# Altium project hw_design.PrjPcb (part 5 of 5)

## Sheet connectors.SchDoc
size A4; SheetNumber: 5; SheetTotal: 5
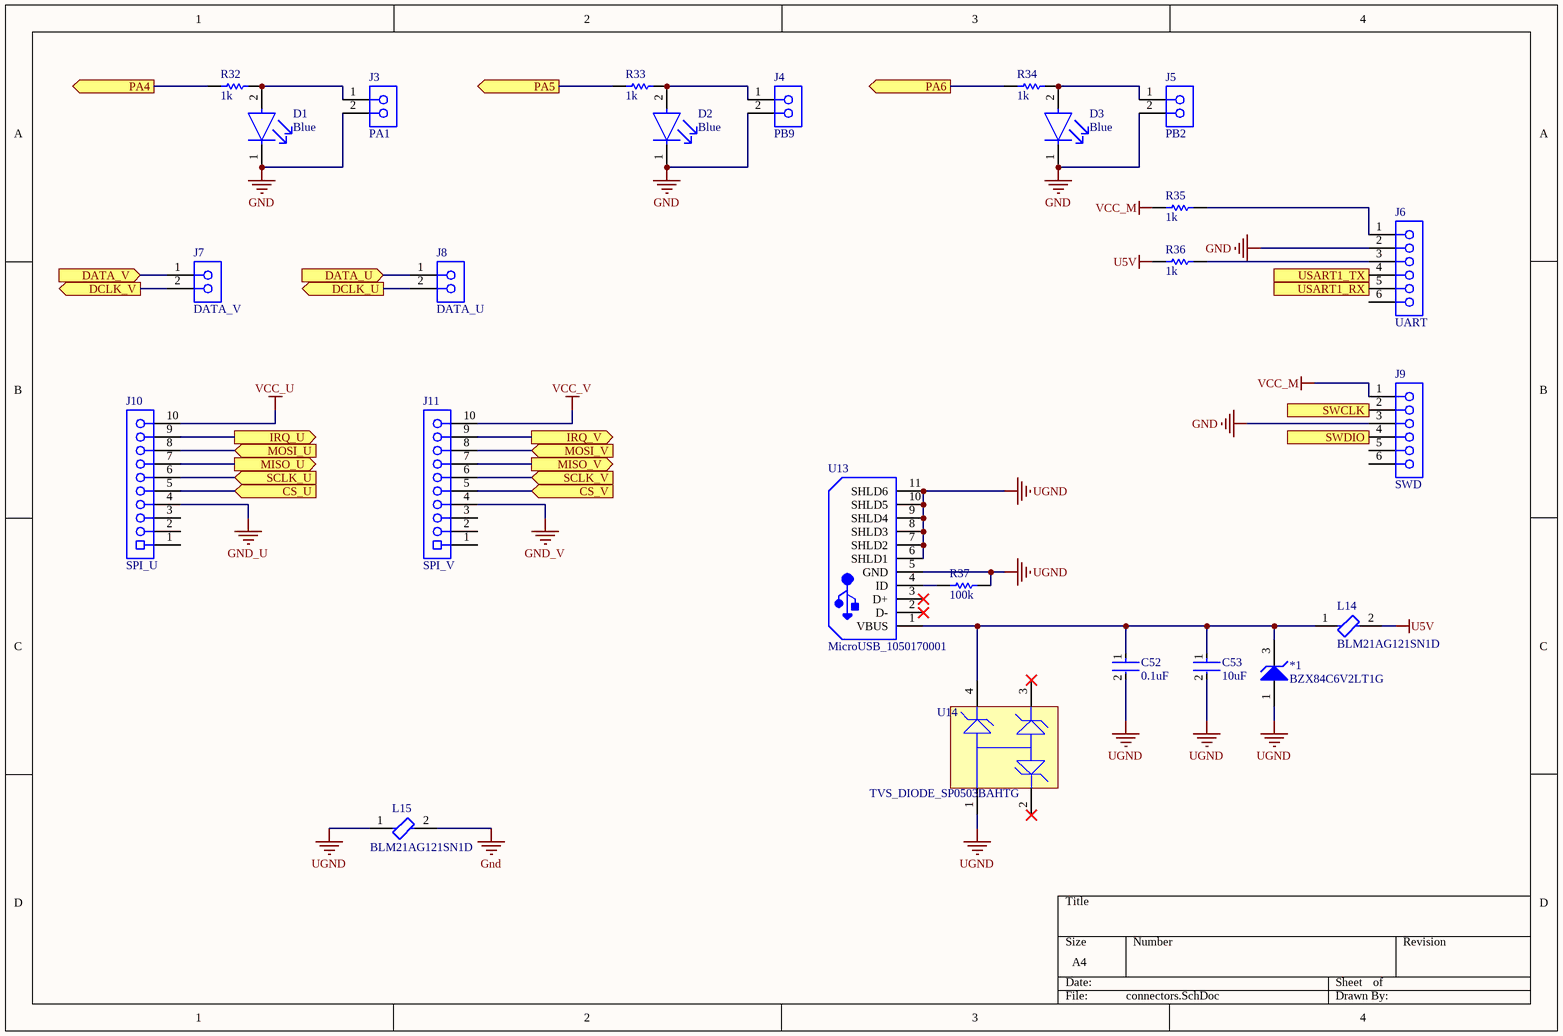
[diagram p4: connectors.SchDoc]

### Parts
*1  BZX84C6V2LT1G  [ONSC-SOT-23-3-318-08_V]
C52  0.1uF  [FP-C0805C-DN-IPC_A]
C53  10uF  [FP-C0805C-DN-IPC_A]
D1  Blue  [FP-C0805C-DN-IPC_A]
D2  Blue  [FP-C0805C-DN-IPC_A]
D3  Blue  [FP-C0805C-DN-IPC_A]
J3  PA1  [SMTC-SSQ-102-01-X-S]
J4  PB9  [SMTC-SSQ-102-01-X-S]
J5  PB2  [SMTC-SSQ-102-01-X-S]
J6  UART  [SMTC-SSW-106-02-X-S-RA]
J7  DATA_V  [SMTC-SSQ-102-01-X-S]
J8  DATA_U  [SMTC-SSQ-102-01-X-S]
J9  SWD  [SMTC-SSW-106-02-X-S-RA]
J10  SPI_U  [61301011821]
J11  SPI_V  [61301011821]
L14  BLM21AG121SN1D  [FP-C0805C-DN-IPC_A]
L15  BLM21AG121SN1D  [FP-C0805C-DN-IPC_A]
R32  1k  [FP-C0805C-DN-IPC_A]
R33  1k  [FP-C0805C-DN-IPC_A]
R34  1k  [FP-C0805C-DN-IPC_A]
R35  1k  [FP-C0805C-DN-IPC_A]
R36  1k  [FP-C0805C-DN-IPC_A]
R37  100k  [FP-C0805C-DN-IPC_A]
U13  MicroUSB_1050170001  [USB-MICRO-B_V]
U14  TVS_DIODE_SP0503BAHTG  [LFUS-SOT143-4_V]

### Ports
CS_U (in), CS_V (in), DATA_U (in), DATA_V (in), DCLK_U (out), DCLK_V (out), IRQ_U (out), IRQ_V (out), MISO_U (out), MISO_V (out), MOSI_U (in), MOSI_V (in), PA4 (out), PA5 (out), PA6 (out), SCLK_U (in), SCLK_V (in), SWCLK (in), SWDIO (out), USART1_RX (in), USART1_TX (out)

### Nets
GND: D1.1(C) D2.1(C) D3.1(C) J3.2 J4.2 J5.2 J6.2 J9.3 L15.2
GND_U: J10.4
GND_V: J11.4
U5V: L14.2 R36.1
UGND: *1.1(A) C52.2 C53.2 L15.1 R37.2 U13.5(GND) U13.6(SHLD1) U13.7(SHLD2) U13.8(SHLD3) U13.9(SHLD4) U13.10(SHLD5) U13.11(SHLD6) U14.1
VCC_M: J9.1 R35.1
VCC_U: J10.10
VCC_V: J11.10
CS_U: J10.5 ; port CS_U
CS_V: J11.5 ; port CS_V
DATA_U: J8.1 ; port DATA_U
DATA_V: J7.1 ; port DATA_V
DCLK_U: J8.2 ; port DCLK_U
DCLK_V: J7.2 ; port DCLK_V
IRQ_U: J10.9 ; port IRQ_U
IRQ_V: J11.9 ; port IRQ_V
MISO_U: J10.7 ; port MISO_U
MISO_V: J11.7 ; port MISO_V
MOSI_U: J10.8 ; port MOSI_U
MOSI_V: J11.8 ; port MOSI_V
PA4: R32.1 ; port PA4
PA5: R33.1 ; port PA5
PA6: R34.1 ; port PA6
SCLK_U: J10.6 ; port SCLK_U
SCLK_V: J11.6 ; port SCLK_V
SWCLK: J9.2 ; port SWCLK
SWDIO: J9.4 ; port SWDIO
USART1_RX: J6.5 ; port USART1_RX
USART1_TX: J6.4 ; port USART1_TX
Net*1_3: *1.3(K) C52.1 C53.1 L14.1 U13.1(VBUS) U14.4
NetD1_2: D1.2(A) J3.1 R32.2
NetD2_2: D2.2(A) J4.1 R33.2
NetD3_2: D3.2(A) J5.1 R34.2
NetJ6_1: J6.1 R35.2
NetJ6_3: J6.3 R36.2
NetR37_1: R37.1 U13.4(ID)

Not connected (* = marked no-connect by the designer): J6 6; J9 5 6; J10 1 2 3; J11 1 2 3; U13 2(D-)* 3(D+)*; U14 2* 3*

### Library data of the parts
*1 = BZX84C6V2LT1G: Vz=6.2V 5.8V~6.6V Izt=5mA P=250mW; Manufacturer: ON Semiconductor; Max Power Dissipation: 225mW; Tolerance: 6%; Zener Voltage: 6.2V; Max Reverse Leakage Current: 3uA; Power Dissipation: 300mW; Test Current: 5mA; Element Configuration: Single; Forward Voltage: 900mV; Impedance: 10R; Zener Current: 10mA; ESD Protection: Yes; Breakdown Voltage: 6.6V; Supplier 1: Digi-Key; Manufacturer Part Number: BZX84C6V2LT1G; RoHS: Yes; Category: Zener Diodes; Pricing 1: 1=0.18000, 10=0.16000, 100=0.08720, 500=0.05364, 1000=0.03657 (USD); Mount: Surface Mount; Case/Package: SOT-23; Number of Pins: 3; Contact Plating: Tin,Matte; Material: Plastic; Min Operating Temperature: -65°C; Max Operating Temperature: 150°C; Package Quantity: 3000; Packaging: Tape and Reel; Voltage Tolerance: 6%; Working Voltage: 6.2V; Max Reverse Current: 3uA; Voltage Rating (DC): 6.2V; Power Rating: 225mW; Termination: SMD/SMT; Length: 2.9mm; Width: 1.3mm; Height: 0.94mm; Radiation Hardening: No; Lead Free: Lead Free; RoHS Compliant: Yes; REACH SVHC: No SVHC; ComponentLink1URL: https://datasheet.ciiva.com/18434/70100187-18434638.pdf?src-supplier=Allied+Electronics; ComponentLink1Description: https://datasheet.ciiva.com/18434/70100187-18434638.pdf?src-supplier=Allied+Electronics; ComponentLink2URL: https://datasheet.ciiva.com/4731/bzx84c2v4lt1-d-71024-4731774.pdf?src-supplier=Mouser; ComponentLink2Description: https://datasheet.ciiva.com/4731/bzx84c2v4lt1-d-71024-4731774.pdf?src-supplier=Mouser; ComponentLink3URL: https://datasheet.ciiva.com/8345/bzx84c2v4lt1-d-8345722.pdf?src-supplier=Avnet; ComponentLink3Description: https://datasheet.ciiva.com/8345/bzx84c2v4lt1-d-8345722.pdf?src-supplier=Avnet; ComponentLink4URL: https://datasheet.ciiva.com/16348/bzx84c2v4lt1-d-16348201.pdf?src-supplier=Future+Electronics; ComponentLink4Description: https://datasheet.ciiva.com/16348/bzx84c2v4lt1-d-16348201.pdf?src-supplier=Future+Electronics; ComponentLink5URL: https://datasheet.ciiva.com/8347/bzx84c2v4lt1-d-8347285.pdf?src-supplier=Avnet; ComponentLink5Description: https://datasheet.ciiva.com/8347/bzx84c2v4lt1-d-8347285.pdf?src-supplier=Avnet; ComponentLink6URL: https://datasheet.ciiva.com/894/bzx84c2v4lt1-d-894738.pdf?src-supplier=Digi-Key; ComponentLink6Description: https://datasheet.ciiva.com/894/bzx84c2v4lt1-d-894738.pdf?src-supplier=Digi-Key; ComponentLink7URL: https://datasheet.ciiva.com/894/bzx84c2v4lt1-d-894739.pdf?src-supplier=Digi-Key; ComponentLink7Description: https://datasheet.ciiva.com/894/bzx84c2v4lt1-d-894739.pdf?src-supplier=Digi-Key; ComponentLink8URL: https://datasheet.ciiva.com/894/bzx84c2v4lt1-d-894737.pdf?src-supplier=Digi-Key; ComponentLink8Description: https://datasheet.ciiva.com/894/bzx84c2v4lt1-d-894737.pdf?src-supplier=Digi-Key; Stock 1: 1080; Supplier Part Number 1: BZX84C6V2LT1GOSCT-ND
C52 = C0805C104K5RACTU: Cap Ceramic 0.1uF 50V X7R 10% SMD 2.0 x 1.2 mm 125 C Paper T/R; Manufacturer: KEMET; Capacitance: 100nF; Voltage: 500V; Supplier 1: Digi-Key; Manufacturer Part Number: C0805C104K5RACTU; RoHS: Yes; Category: Ceramic Capacitors; Pricing 1: 1=0.15000, 10=0.10500, 50=0.05960, 100=0.04940, 500=0.03466, 1000=0.02869 (USD); Mount: Surface Mount,PCB; Case/Package: 0805; Number of Pins: 2; Case Code (Imperial): 0805; Case Code (Metric): 2012; Dielectric Material: Ceramic; Contact Plating: Tin,Matte; Min Operating Temperature: -55°C; Max Operating Temperature: 125°C; Package Quantity: 4000; Voltage Rating: 50V; Tolerance: 10%; Packaging: Tape and Reel; Dielectric: X7R; Termination: SMD/SMT; Voltage Rating (DC): 50V; Series: C0805C; Construction: Flat; Length: 2mm; Width: 1.2mm; Height: 0.9mm; Thickness: 0.035inch; Depth: 1.25mm; Lead Pitch: 0.75mm; Radiation Hardening: No; REACH SVHC: No SVHC; RoHS Compliant: Yes; ComponentLink1URL: https://www.distrelec.biz/Web/Downloads/_t/ds/KEM_C1002_X7R_SMD_eng_tds.pdf?mime=application%2Fpdf&src-supplier=Distrelec; ComponentLink1Description: https://www.distrelec.biz/Web/Downloads/_t/ds/KEM_C1002_X7R_SMD_eng_tds.pdf?mime=application%2Fpdf&src-supplier=Distrelec; ComponentLink2URL: http://www.farnell.com/datasheets/2740684.pdf?src-supplier=Farnell; ComponentLink2Description: http://www.farnell.com/datasheets/2740684.pdf?src-supplier=Farnell; ComponentLink3URL: http://www.farnell.com/datasheets/2740684.pdf?src-supplier=Element14; ComponentLink3Description: http://www.farnell.com/datasheets/2740684.pdf?src-supplier=Element14; Supplier Part Number 1: 399-C0805C104K5RAC7800CT-ND; Stock 1: 2034176
C53 = GRM21BR61C106KE15L: 贴片电容（MLCC） 10μF ±10% 16V X5R 0805; Manufacturer: Murata; Material: Ceramic; Supplier 1: Digi-Key; Manufacturer Part Number: GRM21BR61C106KE15L; RoHS: Yes; Category: Ceramic Capacitors; Pricing 1: 1=0.18000, 10=0.12400, 50=0.07420, 100=0.06270, 500=0.04292, 1000=0.03798 (USD); Mount: Surface Mount; Case/Package: 0805; Case Code (Imperial): 0805; Case Code (Metric): 2012; Min Operating Temperature: -55°C; Max Operating Temperature: 85°C; Packaging: Tape and Reel; Capacitance: 10uF; Tolerance: 10%; Voltage Rating: 16V; Voltage Rating (DC): 16V; Package Quantity: 1; Dielectric: X5R; Termination: SMD/SMT; Voltage: 16V; Series: GRM; Construction: Flat; Length: 2mm; Width: 1.25mm; Height: 1.25mm; Thickness: 0.053inch; Depth: 1.25mm; Radiation Hardening: No; REACH SVHC: No SVHC; RoHS Compliant: Yes; Lead Free: Lead Free; ComponentLink1URL: https://datasheet.ciiva.com/7719/1747468-7719090.pdf?src-supplier=Element14; ComponentLink1Description: https://datasheet.ciiva.com/7719/1747468-7719090.pdf?src-supplier=Element14; ComponentLink2URL: https://datasheet.ciiva.com/23628/460993-23628598.pdf?src-supplier=Newark; ComponentLink2Description: https://datasheet.ciiva.com/23628/460993-23628598.pdf?src-supplier=Newark; ComponentLink3URL: https://datasheet.ciiva.com/2989/product-2989696.pdf?src-supplier=Avnet; ComponentLink3Description: https://datasheet.ciiva.com/2989/product-2989696.pdf?src-supplier=Avnet; ComponentLink4URL: https://datasheet.ciiva.com/3777/1956grm21br61c106ke1523-3777137.pdf?src-supplier=Arrow+Electronics; ComponentLink4Description: https://datasheet.ciiva.com/3777/1956grm21br61c106ke1523-3777137.pdf?src-supplier=Arrow+Electronics; ComponentLink5URL: https://datasheet.ciiva.com/29202/450891-da-01-de-vs-chip-kond-0805-10-0-uf-10pr-16-0v-x5r-29202696.pdf?src-supplier=Conrad; ComponentLink5Description: https://datasheet.ciiva.com/29202/450891-da-01-de-vs-chip-kond-0805-10-0-uf-10pr-16-0v-x5r-29202696.pdf?src-supplier=Conrad; ComponentLink6URL: https://datasheet.ciiva.com/29199/454607-da-01-en-vs-kondensator-0805-29199611.pdf?src-supplier=Conrad; ComponentLink6Description: https://datasheet.ciiva.com/29199/454607-da-01-en-vs-kondensator-0805-29199611.pdf?src-supplier=Conrad; ComponentLink7URL: https://datasheet.ciiva.com/137/partnumbering-e-01-137918.pdf?src-supplier=Digi-Key; ComponentLink7Description: https://datasheet.ciiva.com/137/partnumbering-e-01-137918.pdf?src-supplier=Digi-Key; ComponentLink8URL: https://datasheet.ciiva.com/137/partnumbering-e-01-137917.pdf?src-supplier=Digi-Key; ComponentLink8Description: https://datasheet.ciiva.com/137/partnumbering-e-01-137917.pdf?src-supplier=Digi-Key; ComponentLink9URL: https://datasheet.ciiva.com/137/partnumbering-e-01-137919.pdf?src-supplier=Digi-Key; ComponentLink9Description: https://datasheet.ciiva.com/137/partnumbering-e-01-137919.pdf?src-supplier=Digi-Key; ComponentLink10URL: https://datasheet.ciiva.com/2989/product-2989697.pdf?src-supplier=Avnet; ComponentLink10Description: https://datasheet.ciiva.com/2989/product-2989697.pdf?src-supplier=Avnet; Supplier Part Number 1: 490-3886-1-ND; Stock 1: 9508002
D1-D3 = LTST-C170TBKT: LED BLUE CLEAR 0805 SMD; Manufacturer: Vishay Lite-On; Lens Color: Colorless; Viewing Angle: 130°; Luminous Intensity: 180mcd; Forward Current: 20mA; Forward Voltage: 3.8V; Lens Style: Diffused,Colorless,Clear,Rectangular; Dominant Wavelength: 475nm; Wavelength: 468nm; Number of LEDs: 1; Power Rating: 76mW; Reverse Voltage: 5V; Supplier 1: Digi-Key; Manufacturer Part Number: LTST-C170TBKT; RoHS: Yes; Category: LEDs; Stock 1: 153274; Pricing 1: 1=0.36000, 10=0.23900, 100=0.15930, 500=0.11016, 1000=0.09180 (USD); Mount: Surface Mount; Case/Package: 0805; Number of Pins: 2; Color: Blue; Case Code (Metric): 2012; Case Code (Imperial): 0805; Min Operating Temperature: -20°C; Max Operating Temperature: 80°C; Packaging: Tape and Reel; Package Quantity: 1; Test Current: 20mA; Illumination Color: Blue; Series: -; Lens Transparency: Clear; Number of Elements: 1; Power Dissipation: 76mW; Length: 2mm; Width: 1.25mm; Height: 1.1mm; Depth: 1.25mm; Radiation Hardening: No; RoHS Compliant: Yes; Lead Free: Lead Free; ComponentLink1URL: https://datasheet.ciiva.com/27055/1996161-27055955.pdf?src-supplier=Jameco; ComponentLink1Description: https://datasheet.ciiva.com/27055/1996161-27055955.pdf?src-supplier=Jameco; ComponentLink2URL: https://datasheet.ciiva.com/11773/0900766b80dc0281-11773879.pdf?src-supplier=RSComponents; ComponentLink2Description: https://datasheet.ciiva.com/11773/0900766b80dc0281-11773879.pdf?src-supplier=RSComponents; ComponentLink3URL: https://datasheet.ciiva.com/12400/lite-on-ltst-c170tbkt-190169-12400787.pdf?src-supplier=Mouser; ComponentLink3Description: https://datasheet.ciiva.com/12400/lite-on-ltst-c170tbkt-190169-12400787.pdf?src-supplier=Mouser; ComponentLink4URL: https://datasheet.ciiva.com/16199/lite-on20ltst-c170tbkt-16199611.pdf?src-supplier=Future+Electronics; ComponentLink4Description: https://datasheet.ciiva.com/16199/lite-on20ltst-c170tbkt-16199611.pdf?src-supplier=Future+Electronics; ComponentLink5URL: https://datasheet.ciiva.com/15117/getdatasheetpartid-103986-15117447.pdf?src-supplier=Verical; ComponentLink5Description: https://datasheet.ciiva.com/15117/getdatasheetpartid-103986-15117447.pdf?src-supplier=Verical; ComponentLink6URL: https://datasheet.ciiva.com/25764/ltst-c170tbkt-25764828.pdf?src-supplier=Allied+Electronics; ComponentLink6Description: https://datasheet.ciiva.com/25764/ltst-c170tbkt-25764828.pdf?src-supplier=Allied+Electronics; ComponentLink7URL: https://datasheet.ciiva.com/2110/s-110-ltst-c170tbkt-2110489.pdf?src-supplier=Digi-Key; ComponentLink7Description: https://datasheet.ciiva.com/2110/s-110-ltst-c170tbkt-2110489.pdf?src-supplier=Digi-Key; ComponentLink8URL: https://datasheet.ciiva.com/2110/s-110-ltst-c170tbkt-2110488.pdf?src-supplier=Digi-Key; ComponentLink8Description: https://datasheet.ciiva.com/2110/s-110-ltst-c170tbkt-2110488.pdf?src-supplier=Digi-Key; ComponentLink9URL: https://datasheet.ciiva.com/2110/s-110-ltst-c170tbkt-2110490.pdf?src-supplier=Digi-Key; ComponentLink9Description: https://datasheet.ciiva.com/2110/s-110-ltst-c170tbkt-2110490.pdf?src-supplier=Digi-Key; Supplier Part Number 1: 160-1579-1-ND
J3-J5 J7 J8 = SSQ-102-01-G-S: Headers & Wire Housings Tiger Buy Socket Strip with Square Tails, 0.100 Pitch; Manufacturer: Samtec; Number of Contacts: 2; Gender: Receptacle; Contact Resistance: 10mR; Max Current Rating: 7.6A; Max Voltage Rating (AC): 550V; Pitch: 2.54mm; Supplier 1: Digi-Key; Manufacturer Part Number: SSQ-102-01-G-S; RoHS: Yes; Category: Headers and Wire Housings; Stock 1: 1869; Pricing 1: 1=0.50000, 10=0.46700, 25=0.42000, 50=0.37320, 100=0.35770, 250=0.32660, 500=0.31104 (USD); Mount: Through Hole; Contact Plating: Gold; Contact Material: Bronze; Color: Black; Housing Color: Black; Housing Material: Polymer; Min Operating Temperature: -55°C; Max Operating Temperature: 125°C; Number of Rows: 1; Termination: Solder; Packaging: Bulk; Connector Type: Receptacle; Number of Positions: 2; Orientation: Vertical; Series: SSQ; Contact Type: Female Socket; Current Rating: 7.6A; Voltage Rating: 550V; Length: 5.59mm; Depth: 2.41mm; Radiation Hardening: No; RoHS Compliant: Yes; Lead Free: Lead Free; REACH SVHC: No SVHC; ComponentLink1URL: https://datasheet.ciiva.com/25617/0900766b81159fd6-25617381.pdf?src-supplier=RSComponents; ComponentLink1Description: https://datasheet.ciiva.com/25617/0900766b81159fd6-25617381.pdf?src-supplier=RSComponents; ComponentLink2URL: https://datasheet.ciiva.com/22677/82032-22677596.pdf?src-supplier=Element14; ComponentLink2Description: https://datasheet.ciiva.com/22677/82032-22677596.pdf?src-supplier=Element14; ComponentLink3URL: https://datasheet.ciiva.com/748/ssq-1xx-xx-xxx-x-xx-xxx-xx-x-mkt-748393.pdf?src-supplier=Digi-Key; ComponentLink3Description: https://datasheet.ciiva.com/748/ssq-1xx-xx-xxx-x-xx-xxx-xx-x-mkt-748393.pdf?src-supplier=Digi-Key; Supplier Part Number 1: SAM1180-02-ND
J6 J9 = SSW-106-02-G-S-RA: Conn Socket Strip SKT 6 POS 2.54mm Solder RA Side Entry Thru-Hole Tube; Manufacturer: Samtec; Number of Contacts: 6; Gender: Receptacle; Max Current Rating: 6.9A; Max Voltage Rating (AC): 550V; Mating Cycles: 100; Contact Resistance: 10mR; Supplier 1: Digi-Key; Manufacturer Part Number: SSW-106-02-G-S-RA; RoHS: Yes; Category: Headers and Wire Housings; Stock 1: 2072; Pricing 1: 1=1.36000, 10=1.19700, 25=1.12680, 50=1.07980, 100=1.03280, 250=0.93888, 500=0.84500 (USD); Mount: Through Hole; Contact Plating: Gold; Contact Material: Bronze; Color: Black; Housing Color: Black; Housing Material: Polymer; Min Operating Temperature: -55°C; Max Operating Temperature: 125°C; Number of Rows: 1; Packaging: Bulk; Termination: Solder; Connector Type: Receptacle; Number of Positions: 6; Series: SSW; Contact Type: Female Socket; Orientation: Right Angle; Current Rating: 6.9A; Voltage Rating: 550V; Length: 15.75mm; Pitch: 2.54mm; Depth: 10.03mm; Radiation Hardening: No; RoHS Compliant: Yes; Lead Free: Lead Free; REACH SVHC: No SVHC; ComponentLink1URL: https://datasheet.ciiva.com/25617/0900766b8115c03d-25617516.pdf?src-supplier=RSComponents; ComponentLink1Description: https://datasheet.ciiva.com/25617/0900766b8115c03d-25617516.pdf?src-supplier=RSComponents; ComponentLink2URL: https://datasheet.ciiva.com/22677/82032-22677496.pdf?src-supplier=Element14; ComponentLink2Description: https://datasheet.ciiva.com/22677/82032-22677496.pdf?src-supplier=Element14; ComponentLink3URL: https://datasheet.ciiva.com/750/ssw-1xx-xx-xxx-x-xx-xxx-xx-mkt-750270.pdf?src-supplier=Digi-Key; ComponentLink3Description: https://datasheet.ciiva.com/750/ssw-1xx-xx-xxx-x-xx-xxx-xx-mkt-750270.pdf?src-supplier=Digi-Key; Supplier Part Number 1: SAM1225-06-ND
J10 J11 = 61301011821: THT Vertical Socket Header WR-PHD, Pitch 2.54 mm, Single Row, 10 pins; Manufacturer: Wurth Electronics; Number of Positions: 10; Current Rating: 3A; Gender: Receptacle; Voltage Rating: 250V; Insulation Resistance: 1GR; Insulation: Insulated; Pitch: 2.54mm; Supplier 1: Digi-Key; Manufacturer Part Number: 61301011821; RoHS: Yes; Category: Headers and Wire Housings; Stock 1: 2490; Pricing 1: 1=0.68000, 10=0.66300, 50=0.61200, 100=0.56100, 320=0.51000 (USD); Mount: Through Hole; Contact Plating: Gold; Contact Material: Copper Alloy,Copper; Housing Material: PBT; Color: Black; Min Operating Temperature: -40°C; Max Operating Temperature: 125°C; Number of Rows: 1; Termination: Through Hole; Series: WR-PHD; Package Quantity: 320; Contact Gender: Female; Packaging: Tray; Number of Contacts: 10; Connector Type: Header; Contact Type: Female Socket; Length: 25.9mm; Width: 25.9mm; Height: 8.5mm; RoHS Compliant: Yes; Flammability Rating: UL94 V-0; REACH SVHC: Unknown; Lead Free: Lead Free; ComponentLink1URL: https://datasheet.ciiva.com/8043/1320173-8043339.pdf?src-supplier=Element14; ComponentLink1Description: https://datasheet.ciiva.com/8043/1320173-8043339.pdf?src-supplier=Element14; ComponentLink2URL: https://datasheet.ciiva.com/755/6130xx11821-755848.pdf?src-supplier=Digi-Key; ComponentLink2Description: https://datasheet.ciiva.com/755/6130xx11821-755848.pdf?src-supplier=Digi-Key; ComponentLink3URL: https://datasheet.ciiva.com/48686/001088188-da-01-en-wr-phd-buchsenleiste-61301011821-48686454.pdf?src-supplier=Conrad; ComponentLink3Description: https://datasheet.ciiva.com/48686/001088188-da-01-en-wr-phd-buchsenleiste-61301011821-48686454.pdf?src-supplier=Conrad; Supplier Part Number 1: 732-2859-ND
L14 L15 = BLM21AG121SN1D: 0805 120Ω ±25% DCR=0.09Ω 1A ferrite bead; Manufacturer: Murata; Material: Steel,Ferrite; Impedance: 120R; Current Rating: 800mA; Max DC Current: 200mA; DC Resistance (DCR): 100mR; Test Frequency: 100MHz; Number of Lines: 1; Shielding: Unshielded; Resistance: 150mR; Supplier 1: Mouser; Manufacturer Part Number: BLM21AG121SN1D; RoHS: Yes; Category: Inductors; Pricing 1: 1=0.15000, 10=0.07700, 50=0.07700, 100=0.05300, 500=0.04800, 1000=0.04200, 4000=0.04000, 10000=0.04000 (USD); Case/Package: 0805; Number of Pins: 2; Case Code (Metric): 2012; Case Code (Imperial): 0805; Core Material: Ferrite; Min Operating Temperature: -55°C; Max Operating Temperature: 125°C; Package Quantity: 1; Packaging: Tape and Reel; Tolerance: 25%; Termination: SMD/SMT; Series: BLM21A; Max Current Rating: 1A; DC Resistance-Max: 100mR; DC Current: 200mA; Frequency: 100MHz; Number of Circuits: 1; Length: 2mm; Width: 1.25mm; Height: 0.85mm; Depth: 1.25mm; Radiation Hardening: No; REACH SVHC: No SVHC; Lead Free: Lead Free; RoHS Compliant: Yes; Military Standard: Not; ComponentLink1URL: https://datasheet.ciiva.com/5709/5155-5709216.pdf?src-supplier=Farnell; ComponentLink1Description: https://datasheet.ciiva.com/5709/5155-5709216.pdf?src-supplier=Farnell; ComponentLink2URL: https://datasheet.ciiva.com/41449/001172324-da-01-en-drossel-0805-120r-2-0x1-25mm-4000st-41449639.pdf?src-supplier=Conrad; ComponentLink2Description: https://datasheet.ciiva.com/41449/001172324-da-01-en-drossel-0805-120r-2-0x1-25mm-4000st-41449639.pdf?src-supplier=Conrad; ComponentLink3URL: https://datasheet.ciiva.com/29347/442447-da-01-en-chip-drossel-0805-120r-200ma-2-0x1-25mm-29347998.pdf?src-supplier=Conrad; ComponentLink3Description: https://datasheet.ciiva.com/29347/442447-da-01-en-chip-drossel-0805-120r-200ma-2-0x1-25mm-29347998.pdf?src-supplier=Conrad; ComponentLink4URL: https://datasheet.ciiva.com/1012/l0110s0100blm21a-1012654.pdf?src-supplier=Digi-Key; ComponentLink4Description: https://datasheet.ciiva.com/1012/l0110s0100blm21a-1012654.pdf?src-supplier=Digi-Key; ComponentLink5URL: https://datasheet.ciiva.com/1012/l0110s0100blm21a-1012653.pdf?src-supplier=Digi-Key; ComponentLink5Description: https://datasheet.ciiva.com/1012/l0110s0100blm21a-1012653.pdf?src-supplier=Digi-Key; ComponentLink6URL: https://datasheet.ciiva.com/1012/l0110s0100blm21a-1012655.pdf?src-supplier=Digi-Key; ComponentLink6Description: https://datasheet.ciiva.com/1012/l0110s0100blm21a-1012655.pdf?src-supplier=Digi-Key; ComponentLink7URL: https://datasheet.ciiva.com/3081/l0110s0100blm21a-3081641.pdf?src-supplier=Avnet; ComponentLink7Description: https://datasheet.ciiva.com/3081/l0110s0100blm21a-3081641.pdf?src-supplier=Avnet; ComponentLink8URL: https://datasheet.ciiva.com/16355/l0110s0100blm21a-16355286.pdf?src-supplier=Future+Electronics; ComponentLink8Description: https://datasheet.ciiva.com/16355/l0110s0100blm21a-16355286.pdf?src-supplier=Future+Electronics; ComponentLink9URL: https://datasheet.ciiva.com/3082/l0110s0100blm21a-3082729.pdf?src-supplier=Avnet; ComponentLink9Description: https://datasheet.ciiva.com/3082/l0110s0100blm21a-3082729.pdf?src-supplier=Avnet; Supplier Part Number 1: 81-BLM21AG121SN1D
R32-R36 = CRCW08051K00FKEA: Res Thick Film 0805 1K Ohm 1% 1/8W ±100ppm/°C Molded SMD Paper T/R; Manufacturer: Vishay Dale; Voltage Rating: 150V; Power Rating: 125mW; Resistance: 1kR; Supplier 1: Digi-Key; Manufacturer Part Number: CRCW08051K00FKEA; RoHS: Yes; Category: Chip SMD Resistors; Stock 1: 6505; Pricing 1: 1=0.10000, 10=0.06700, 100=0.02710, 1000=0.01219, 2500=0.01058 (USD); Case/Package: 0805; Number of Pins: 2; Case Code (Imperial): 0805; Case Code (Metric): 2012; Contact Plating: Tin; Size Code: 0805; Weight: 0.000194oz; Min Operating Temperature: -55°C; Max Operating Temperature: 155°C; Packaging: Tape and Reel; Tolerance: 1%; Resistor Type: Thick Film; Termination: SMD/SMT; Temperature Coefficient: 100ppm/°C; Series: CRCW; Max Power Dissipation: 125mW; Number of Terminations: 2; Resistance Tolerance: 1%; Package Quantity: 5000; Voltage Rating (DC): 150V; Construction: Rectangular; Features: Automotive AEC-Q200; Technology: THICK FILM; Length: 2mm; Width: 1.25mm; Height: 0.45mm; Depth: 1.25mm; Radiation Hardening: No; REACH SVHC: Unknown; RoHS Compliant: Yes; Military Standard: Not; Lead Free: Lead Free; ComponentLink1URL: https://datasheet.ciiva.com/11808/0900766b80d98b26-11808530.pdf?src-supplier=RSComponents; ComponentLink1Description: https://datasheet.ciiva.com/11808/0900766b80d98b26-11808530.pdf?src-supplier=RSComponents; ComponentLink2URL: https://datasheet.ciiva.com/3258/dcrcwe3-3258215.pdf?src-supplier=Avnet; ComponentLink2Description: https://datasheet.ciiva.com/3258/dcrcwe3-3258215.pdf?src-supplier=Avnet; ComponentLink3URL: https://datasheet.ciiva.com/26312/fld-crcw-e3-data-en-26312922.pdf?src-supplier=Distrelec; ComponentLink3Description: https://datasheet.ciiva.com/26312/fld-crcw-e3-data-en-26312922.pdf?src-supplier=Distrelec; ComponentLink4URL: https://datasheet.ciiva.com/16213/dcrcwe3-16213643.pdf?src-supplier=Future+Electronics; ComponentLink4Description: https://datasheet.ciiva.com/16213/dcrcwe3-16213643.pdf?src-supplier=Future+Electronics; ComponentLink5URL: https://datasheet.ciiva.com/46381/1697337-46381606.pdf?src-supplier=Element14; ComponentLink5Description: https://datasheet.ciiva.com/46381/1697337-46381606.pdf?src-supplier=Element14; ComponentLink6URL: https://datasheet.ciiva.com/46441/1720486-46441626.pdf?src-supplier=Element14; ComponentLink6Description: https://datasheet.ciiva.com/46441/1720486-46441626.pdf?src-supplier=Element14; Supplier Part Number 1: 541-1.00KCDKR-ND
R37 = RC0805FR-07100KL: 贴片电阻 100000Ω ± 1.00% 0.125W ± 100ppm/℃ 0805; Manufacturer: Yageo; Tolerance: 1%; Voltage Rating: 150V; Temperature Coefficient: 100ppm/°C; Resistance: 100kR; Power Rating: 125mW; Supplier 1: Digi-Key; Manufacturer Part Number: RC0805FR-07100KL; RoHS: Yes; Category: Chip SMD Resistors; Pricing 1: 1=0.10000, 10=0.04200, 100=0.01690, 1000=0.00759, 2500=0.00659 (USD); Case/Package: 0805; Number of Pins: 2; Case Code (Metric): 2012; Case Code (Imperial): 0805; Size Code: 0805; Min Operating Temperature: -55°C; Max Operating Temperature: 155°C; Voltage Rating (DC): 150V; Packaging: Tape and Reel; Termination: SMD/SMT; Series: RC; Package Quantity: 1; Resistor Type: Thick Film; Number of Terminations: 2; Max Power Dissipation: 125mW; Resistance Tolerance: 1%; Features: Moisture Resistant; Construction: Rectangular; Technology: THICK FILM; Length: 2mm; Width: 0.049inch; Height: 0.024inch; Depth: 1.25mm; Lead Pitch: 0.4mm; REACH SVHC: Unknown; RoHS Compliant: Yes; Lead Free: Lead Free; Military Standard: Not; ComponentLink1URL: https://datasheet.ciiva.com/7941/1686128-7941677.pdf?src-supplier=Element14; ComponentLink1Description: https://datasheet.ciiva.com/7941/1686128-7941677.pdf?src-supplier=Element14; ComponentLink2URL: https://datasheet.ciiva.com/7660/38627-7660796.pdf?src-supplier=Element14; ComponentLink2Description: https://datasheet.ciiva.com/7660/38627-7660796.pdf?src-supplier=Element14; Supplier Part Number 1: 311-100KCRCT-ND; Stock 1: 2547195
U13 = 1050170001: CONN RCPT MICRO USB R/A SMD; Manufacturer: Molex; Number of Terminals/Pins: 5; Gender: Receptacle; Connector Type: USB,Receptacle; USB Standard: USB 2.0; Current Rating: 1.8A; Number of Ports: 1; Voltage Rating (AC): 30V; Mating Cycles: 10000; Shielding: Shielded; Pitch: 0.65mm; Supplier 1: Digi-Key; Manufacturer Part Number: 1050170001; RoHS: Yes; Category: Connectors; Pricing 1: 1=0.96000, 10=0.79400, 100=0.66150, 1000=0.52920 (USD); Mount: Surface Mount,Through Hole,Horizontal; Contact Plating: Gold; Contact Material: Copper Alloy,Copper; Housing Material: Polymer; Insulation Color: Black; Min Operating Temperature: -30°C; Max Operating Temperature: 85°C; Packaging: Tape and Reel; Number of Contacts: 5; Orientation: Right Angle; Termination: Solder; Series: 105017; Max Voltage Rating (AC): 30V; Voltage Rating: 30V; Features: Shielded; Package Quantity: 2000; Number of Positions: 5; Number of Circuits: 5; Length: 8.2mm; Depth: 7.5mm; Radiation Hardening: No; REACH SVHC: Unknown; RoHS Compliant: Yes; Flammability Rating: UL94 V-0; Halogen Free: Low Halogen; ComponentLink1URL: https://datasheet.ciiva.com/30165/235271050170001-io-nectors-30165183.pdf?src-supplier=Onlinecomponents.com; ComponentLink1Description: https://datasheet.ciiva.com/30165/235271050170001-io-nectors-30165183.pdf?src-supplier=Onlinecomponents.com; ComponentLink2URL: https://datasheet.ciiva.com/8015/1631959-8015288.pdf?src-supplier=Element14; ComponentLink2Description: https://datasheet.ciiva.com/8015/1631959-8015288.pdf?src-supplier=Element14; ComponentLink3URL: https://datasheet.ciiva.com/5742/1598502-5742508.pdf?src-supplier=Farnell; ComponentLink3Description: https://datasheet.ciiva.com/5742/1598502-5742508.pdf?src-supplier=Farnell; ComponentLink4URL: https://datasheet.ciiva.com/22654/1688140-22654924.pdf?src-supplier=Element14; ComponentLink4Description: https://datasheet.ciiva.com/22654/1688140-22654924.pdf?src-supplier=Element14; ComponentLink5URL: https://datasheet.ciiva.com/3094/1050170001-io-connectors-3094416.pdf?src-supplier=Avnet; ComponentLink5Description: https://datasheet.ciiva.com/3094/1050170001-io-connectors-3094416.pdf?src-supplier=Avnet; ComponentLink6URL: https://datasheet.ciiva.com/4598/1050170001-io-connectors-152207-4598759.pdf?src-supplier=Mouser; ComponentLink6Description: https://datasheet.ciiva.com/4598/1050170001-io-connectors-152207-4598759.pdf?src-supplier=Mouser; ComponentLink7URL: https://datasheet.ciiva.com/851/1050170001-sd-851276.pdf?src-supplier=Digi-Key; ComponentLink7Description: https://datasheet.ciiva.com/851/1050170001-sd-851276.pdf?src-supplier=Digi-Key; ComponentLink8URL: https://datasheet.ciiva.com/16668/1050170001-io-connectors-16668598.pdf?src-supplier=Avnet+Europe; ComponentLink8Description: https://datasheet.ciiva.com/16668/1050170001-io-connectors-16668598.pdf?src-supplier=Avnet+Europe; ComponentLink9URL: https://datasheet.ciiva.com/851/1050170001-sd-851277.pdf?src-supplier=Digi-Key; ComponentLink9Description: https://datasheet.ciiva.com/851/1050170001-sd-851277.pdf?src-supplier=Digi-Key; ComponentLink10URL: https://datasheet.ciiva.com/851/1050170001-sd-851278.pdf?src-supplier=Digi-Key; ComponentLink10Description: https://datasheet.ciiva.com/851/1050170001-sd-851278.pdf?src-supplier=Digi-Key; Supplier Part Number 1: WM1399CT-ND; Stock 1: 284736
U14 = SP0503BAHTG: TVS二极管 5.5V 单向; Manufacturer: Littelfuse; Element Configuration: Common Anode; Direction: Unidirectional; Capacitance: 30pF; Number of Channels: 3; Clamping Voltage: 7.8V; Power Line Protection: No; Polarity: Bidirectional,Unidirectional; Max Power Dissipation: 225mW; ESD Protection: Yes; Max Reverse Leakage Current: 100nA; Voltage Rating (DC): 5V; Diode Type: Avalanche; Clamping Voltage-Max: 8V; Supplier 1: Digi-Key; Manufacturer Part Number: SP0503BAHTG; RoHS: Yes; Category: TVS Diodes; Pricing 1: 1=0.92000, 10=0.81200, 100=0.62260, 500=0.49214, 1000=0.39371 (USD); Mount: Surface Mount; Case/Package: SOT-143; Number of Pins: 4; Min Operating Temperature: -40°C; Max Operating Temperature: 85°C; Operating Supply Voltage: 5.5V; Packaging: Tape and Reel; Number of Unidirectional Channels: 3; Reverse Standoff Voltage: 5.5V; Breakdown Voltage: 5.5V; Termination: SMD/SMT; Working Voltage: 5.5V; Peak Pulse Power: 225mW; Leakage Current: 100nA; Number of Elements: 3; Power Dissipation: 225mW; Resistor Type: Zener; Series: SP05, SPA®; Length: 3.04mm; Width: 1.4mm; Height: 1.05mm; Depth: 1.4mm; Radiation Hardening: No; REACH SVHC: No SVHC; Lead Free: Lead Free; RoHS Compliant: Yes; ComponentLink1URL: https://datasheet.ciiva.com/15143/getdatasheetpartid-116020-15143550.pdf?src-supplier=Verical; ComponentLink1Description: https://datasheet.ciiva.com/15143/getdatasheetpartid-116020-15143550.pdf?src-supplier=Verical; ComponentLink2URL: https://datasheet.ciiva.com/7650/526672-7650894.pdf?src-supplier=Element14; ComponentLink2Description: https://datasheet.ciiva.com/7650/526672-7650894.pdf?src-supplier=Element14; ComponentLink3URL: https://datasheet.ciiva.com/8062/littefuse-spa-sp050x-8062422.pdf?src-supplier=Element14; ComponentLink3Description: https://datasheet.ciiva.com/8062/littefuse-spa-sp050x-8062422.pdf?src-supplier=Element14; ComponentLink4URL: https://datasheet.ciiva.com/22697/1911798-22697942.pdf?src-supplier=Element14; ComponentLink4Description: https://datasheet.ciiva.com/22697/1911798-22697942.pdf?src-supplier=Element14; ComponentLink5URL: https://datasheet.ciiva.com/4509/sp05x-leadfree-4509162.pdf?src-supplier=Mouser; ComponentLink5Description: https://datasheet.ciiva.com/4509/sp05x-leadfree-4509162.pdf?src-supplier=Mouser; ComponentLink6URL: https://datasheet.ciiva.com/332/sp05xxba-332551.pdf?src-supplier=Digi-Key; ComponentLink6Description: https://datasheet.ciiva.com/332/sp05xxba-332551.pdf?src-supplier=Digi-Key; ComponentLink7URL: https://datasheet.ciiva.com/332/sp05xxba-332552.pdf?src-supplier=Digi-Key; ComponentLink7Description: https://datasheet.ciiva.com/332/sp05xxba-332552.pdf?src-supplier=Digi-Key; ComponentLink8URL: https://datasheet.ciiva.com/332/sp05xxba-332550.pdf?src-supplier=Digi-Key; ComponentLink8Description: https://datasheet.ciiva.com/332/sp05xxba-332550.pdf?src-supplier=Digi-Key; ComponentLink9URL: https://datasheet.ciiva.com/16449/sp05xxba-16449463.pdf?src-supplier=Future+Electronics; ComponentLink9Description: https://datasheet.ciiva.com/16449/sp05xxba-16449463.pdf?src-supplier=Future+Electronics; Supplier Part Number 1: F2715CT-ND; Stock 1: 2768

## Nets that join several sheets
GND: mcu (30 pins), comms_uhf (R8.1), comms_vhf (R9.2), power_regulation (35 pins), connectors (9 pins)
GND_U: comms_uhf (20 pins), connectors (J10.4)
GND_V: comms_vhf (23 pins), connectors (J11.4)
VCC_M: mcu (22 pins), power_regulation (R17.2 U5.4 U8.4), connectors (J9.1 R35.1)
VCC_U: comms_uhf (C7.1 C8.1 U2.23), power_regulation (R27.2 U12.4), connectors (J10.10)
VCC_V: comms_vhf (C21.1 C22.1 U3.23), power_regulation (R22.2 U10.4), connectors (J11.10)
CS_U: mcu (B1.50), comms_uhf (U2.14), connectors (J10.5)
CS_V: mcu (B1.33), comms_vhf (U3.14), connectors (J11.5)
DATA_U: mcu (B1.53), comms_uhf (U2.11), connectors (J8.1)
DATA_V: mcu (B1.38), comms_vhf (U3.11), connectors (J7.1)
DCLK_U: mcu (B1.54), comms_uhf (U2.12), connectors (J8.2)
DCLK_V: mcu (B1.37), comms_vhf (U3.12), connectors (J7.2)
I_5V: mcu (B1.14), power_regulation (C39.1 R13.1)
I_VCC_M: mcu (B1.9), power_regulation (C43.1 R20.1)
I_VCC_U: mcu (B1.10), power_regulation (C51.1 R30.1)
I_VCC_V: mcu (B1.11), power_regulation (C47.1 R25.1)
IRQ_U: mcu (B1.15), comms_uhf (U2.19), connectors (J10.9)
IRQ_V: mcu (B1.16), comms_vhf (U3.19), connectors (J11.9)
MISO_U: mcu (B1.56), comms_uhf (U2.16), connectors (J10.7)
MISO_V: mcu (B1.35), comms_vhf (U3.16), connectors (J11.7)
MOSI_U: mcu (B1.57), comms_uhf (U2.17), connectors (J10.8)
MOSI_V: mcu (B1.36), comms_vhf (U3.17), connectors (J11.8)
PA4: mcu (B1.20), connectors (R32.1)
PA5: mcu (B1.21), connectors (R33.1)
PA6: mcu (B1.22), connectors (R34.1)
SCLK_U: mcu (B1.55), comms_uhf (U2.15), connectors (J10.6)
SCLK_V: mcu (B1.34), comms_vhf (U3.15), connectors (J11.6)
SWCLK: mcu (B1.49), connectors (J9.2)
SWDIO: mcu (B1.46), connectors (J9.4)
TCXO_U: mcu (R4.2), comms_uhf (C14.2)
TCXO_V: mcu (R5.1), comms_vhf (C31.2)
USART1_RX: mcu (B1.43), connectors (J6.5)
USART1_TX: mcu (B1.42), connectors (J6.4)